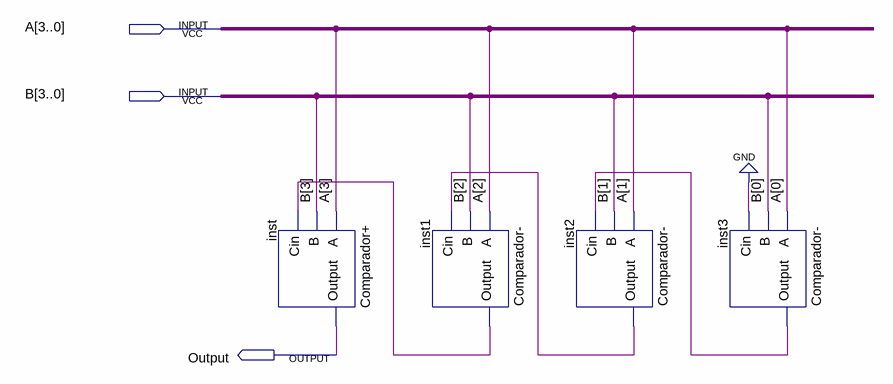
[diagram p0: schematic sheet]
// Quartus schematic Comparador Maior que.bdf as structural Verilog: 4 symbols, 3 pins
module \Comparador_Maior_que  (
  input  [3:0] A,
  input  [3:0] B,
  output Output
);

  wire inst1_output, inst2_output, inst3_output;

  \Comparador+  inst (.A(A[3]), .B(B[3]), .Cin(inst1_output), .Output(Output));
  \Comparador-  inst1 (.A(A[2]), .B(B[2]), .Cin(inst2_output), .Output(inst1_output));
  \Comparador-  inst2 (.A(A[1]), .B(B[1]), .Cin(inst3_output), .Output(inst2_output));
  \Comparador-  inst3 (.A(A[0]), .B(B[0]), .Cin(1'b0), .Output(inst3_output));
endmodule
